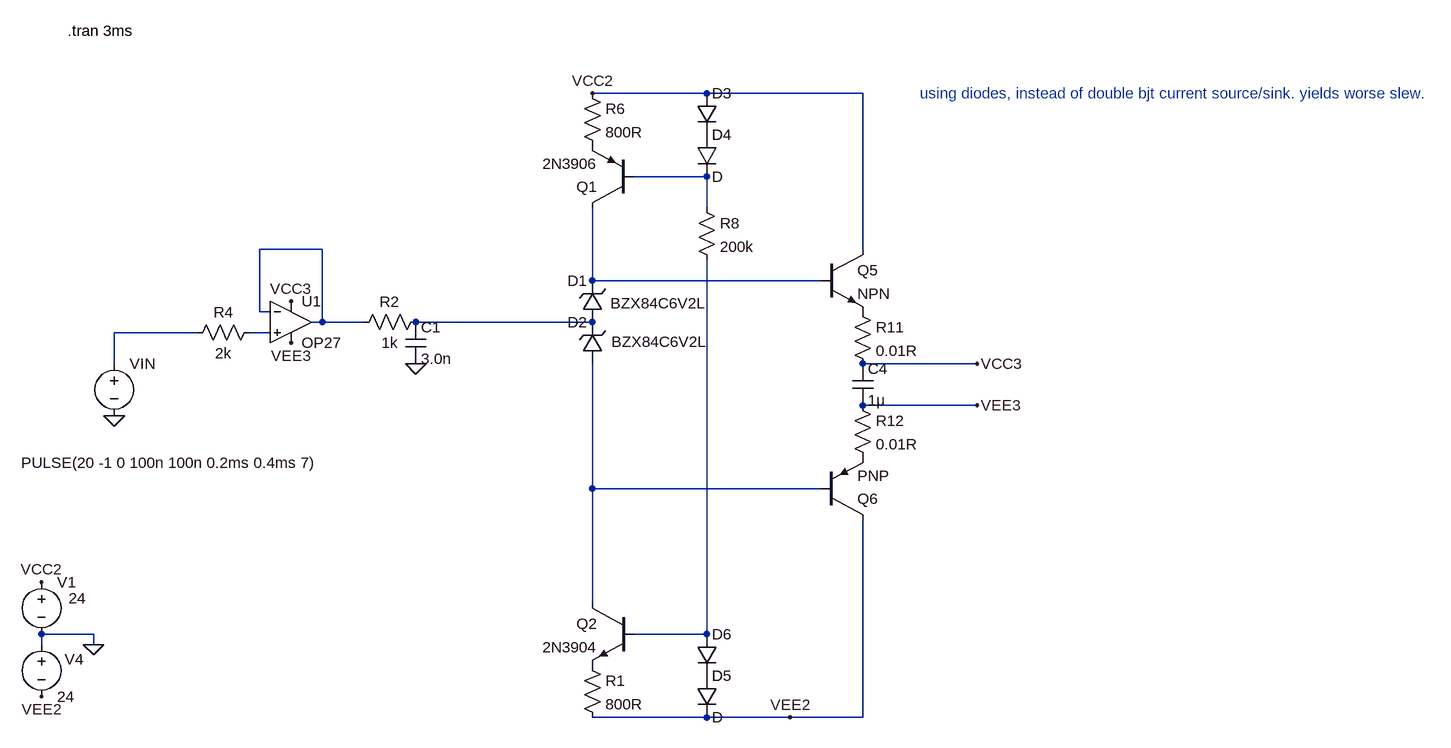
[diagram p0: schematic Draft44.asc]
Draft44.asc, the LTspice schematic file:
Version 4
SHEET 1 2336 896
WIRE 880 -192 704 -192
WIRE 1120 -192 880 -192
WIRE 880 -64 768 -64
WIRE 880 -16 880 -64
WIRE 288 48 192 48
WIRE 1120 48 1120 -192
WIRE 704 96 704 -16
WIRE 1056 96 704 96
WIRE 192 144 192 48
WIRE 208 144 192 144
WIRE 288 160 288 48
WIRE 288 160 272 160
WIRE 352 160 288 160
WIRE 704 160 432 160
WIRE 96 176 -32 176
WIRE 208 176 176 176
WIRE -32 224 -32 176
WIRE 1296 224 1120 224
WIRE 1296 288 1120 288
WIRE 704 416 704 224
WIRE 1056 416 704 416
WIRE 704 592 704 416
WIRE -64 640 -144 640
WIRE 880 640 880 64
WIRE 880 640 768 640
WIRE -144 656 -144 640
WIRE -64 656 -64 640
WIRE 880 768 704 768
WIRE 1008 768 880 768
WIRE 1120 768 1120 464
WIRE 1120 768 1008 768
FLAG -32 304 0
FLAG -64 656 0
FLAG -144 560 VCC2
FLAG -144 736 VEE2
FLAG 704 -192 VCC2
FLAG 1008 768 VEE2
FLAG 1296 224 VCC3
FLAG 1296 288 VEE3
FLAG 240 128 VCC3
FLAG 240 192 VEE3
FLAG 432 224 0
SYMBOL voltage -32 208 R0
WINDOW 123 0 0 Left 0
WINDOW 39 0 0 Left 0
WINDOW 3 -143 168 Left 2
SYMATTR Value PULSE(20 -1 0 100n 100n 0.2ms 0.4ms 7)
SYMATTR InstName VIN
SYMBOL res 192 160 R90
WINDOW 0 0 56 VBottom 2
WINDOW 3 32 56 VTop 2
SYMATTR InstName R4
SYMATTR Value 2k
SYMBOL pnp 768 -16 R180
SYMATTR InstName Q1
SYMATTR Value 2N3906
SYMBOL res 688 -208 R0
SYMATTR InstName R6
SYMATTR Value 800R
SYMBOL voltage -144 544 R0
WINDOW 123 0 0 Left 0
WINDOW 39 0 0 Left 0
WINDOW 3 42 41 Left 2
SYMATTR Value 24
SYMATTR InstName V1
SYMBOL voltage -144 640 R0
WINDOW 123 0 0 Left 0
WINDOW 39 0 0 Left 0
WINDOW 0 36 39 Left 2
SYMATTR InstName V4
SYMATTR Value 24
SYMBOL res 864 -32 R0
SYMATTR InstName R8
SYMATTR Value 200k
SYMBOL zener 720 160 R180
WINDOW 0 24 64 Left 2
WINDOW 3 -159 29 Left 2
SYMATTR InstName D1
SYMATTR Value BZX84C6V2L
SYMBOL npn 1056 48 R0
SYMATTR InstName Q5
SYMBOL res 1104 128 R0
SYMATTR InstName R11
SYMATTR Value 0.01R
SYMBOL res 1104 272 R0
SYMATTR InstName R12
SYMATTR Value 0.01R
SYMBOL cap 1104 224 R0
SYMATTR InstName C4
SYMATTR Value 1µ
SYMBOL pnp 1056 464 M180
SYMATTR InstName Q6
SYMBOL zener 720 224 R180
WINDOW 0 24 64 Left 2
WINDOW 3 -160 34 Left 2
SYMATTR InstName D2
SYMATTR Value BZX84C6V2L
SYMBOL npn 768 592 M0
SYMATTR InstName Q2
SYMATTR Value 2N3904
SYMBOL res 688 672 R0
SYMATTR InstName R1
SYMATTR Value 800R
SYMBOL res 448 144 R90
WINDOW 0 0 56 VBottom 2
WINDOW 3 32 56 VTop 2
SYMATTR InstName R2
SYMATTR Value 1k
SYMBOL cap 416 160 R0
SYMATTR InstName C1
SYMATTR Value 3.0n
SYMBOL OpAmps\\OP27 240 96 R0
SYMATTR InstName U1
SYMBOL diode 864 -192 R0
SYMATTR InstName D3
SYMBOL diode 864 -128 R0
SYMATTR InstName D4
SYMBOL diode 864 704 R0
SYMATTR InstName D5
SYMBOL diode 864 640 R0
SYMATTR InstName D6
TEXT -104 -288 Left 2 !.tran 3ms
TEXT 1208 -192 Left 2 ;using diodes, instead of double bjt current source/sink. yields worse slew.

The netlist it stands for:
* Draft44.asc
VIN N005 0 PULSE(20 -1 0 100n 100n 0.2ms 0.4ms 7)
R4 N006 N005 2k
Q1 N003 N001 P001 0 2N3906
R6 VCC2 P001 800R
V1 VCC2 0 24
V4 0 VEE2 24
R8 N001 N008 200k
D1 N004 N003 BZX84C6V2L
Q5 VCC2 N003 P002 0 NPN
R11 P002 VCC3 0.01R
R12 VEE3 P003 0.01R
C4 VCC3 VEE3 1µ
Q6 VEE2 N007 P003 0 PNP
D2 N007 N004 BZX84C6V2L
Q2 N007 N008 P004 0 2N3904
R1 P004 VEE2 800R
R2 N004 N002 1k
C1 N004 0 3.0n
XU1 N006 N002 VCC3 VEE3 N002 OP27  ; pins In+ In- V+ V- OUT
D3 VCC2 P005 D
D4 P005 N001 D
D5 P006 VEE2 D
D6 N008 P006 D
.model D D
.lib standard.dio
.model NPN NPN
.model PNP PNP
.lib standard.bjt
.tran 3ms
* using diodes, instead of double bjt current source/sink. yields worse slew.
.lib ADI.lib
.backanno
.end